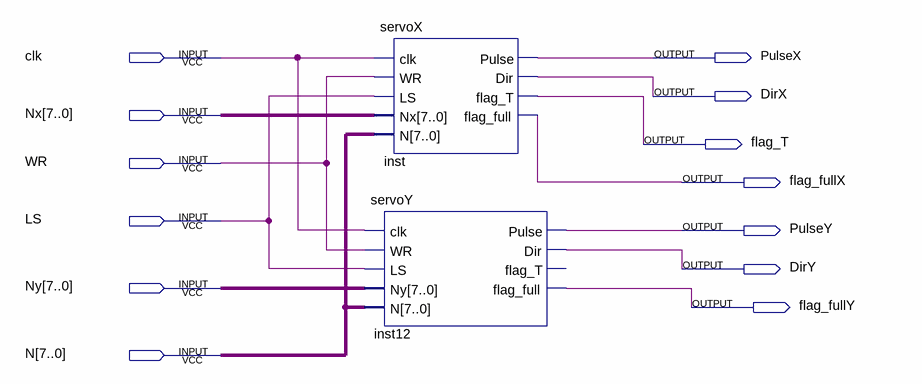
[diagram p0: schematic sheet]
// Quartus schematic CNC.bdf as structural Verilog: 2 symbols, 13 pins
module CNC (
  input  clk,
  input  [7:0] Nx,
  input  WR,
  input  LS,
  input  [7:0] Ny,
  input  [7:0] N,
  output PulseX,
  output DirX,
  output flag_T,
  output flag_fullX,
  output PulseY,
  output DirY,
  output flag_fullY
);

  servoY inst12 (
    .clk(clk), .WR(WR), .LS(LS), .Ny(Ny), .N(N), .Pulse(PulseY), .Dir(DirY), .flag_full(flag_fullY));  // open: flag_T
  servoX inst (
    .clk(clk), .WR(WR), .LS(LS), .Nx(Nx), .N(N), .Pulse(PulseX), .Dir(DirX), .flag_T(flag_T),
    .flag_full(flag_fullX));
endmodule
